# EAGLE design Sedna Monitor Board (EAGLE 9.6.2)
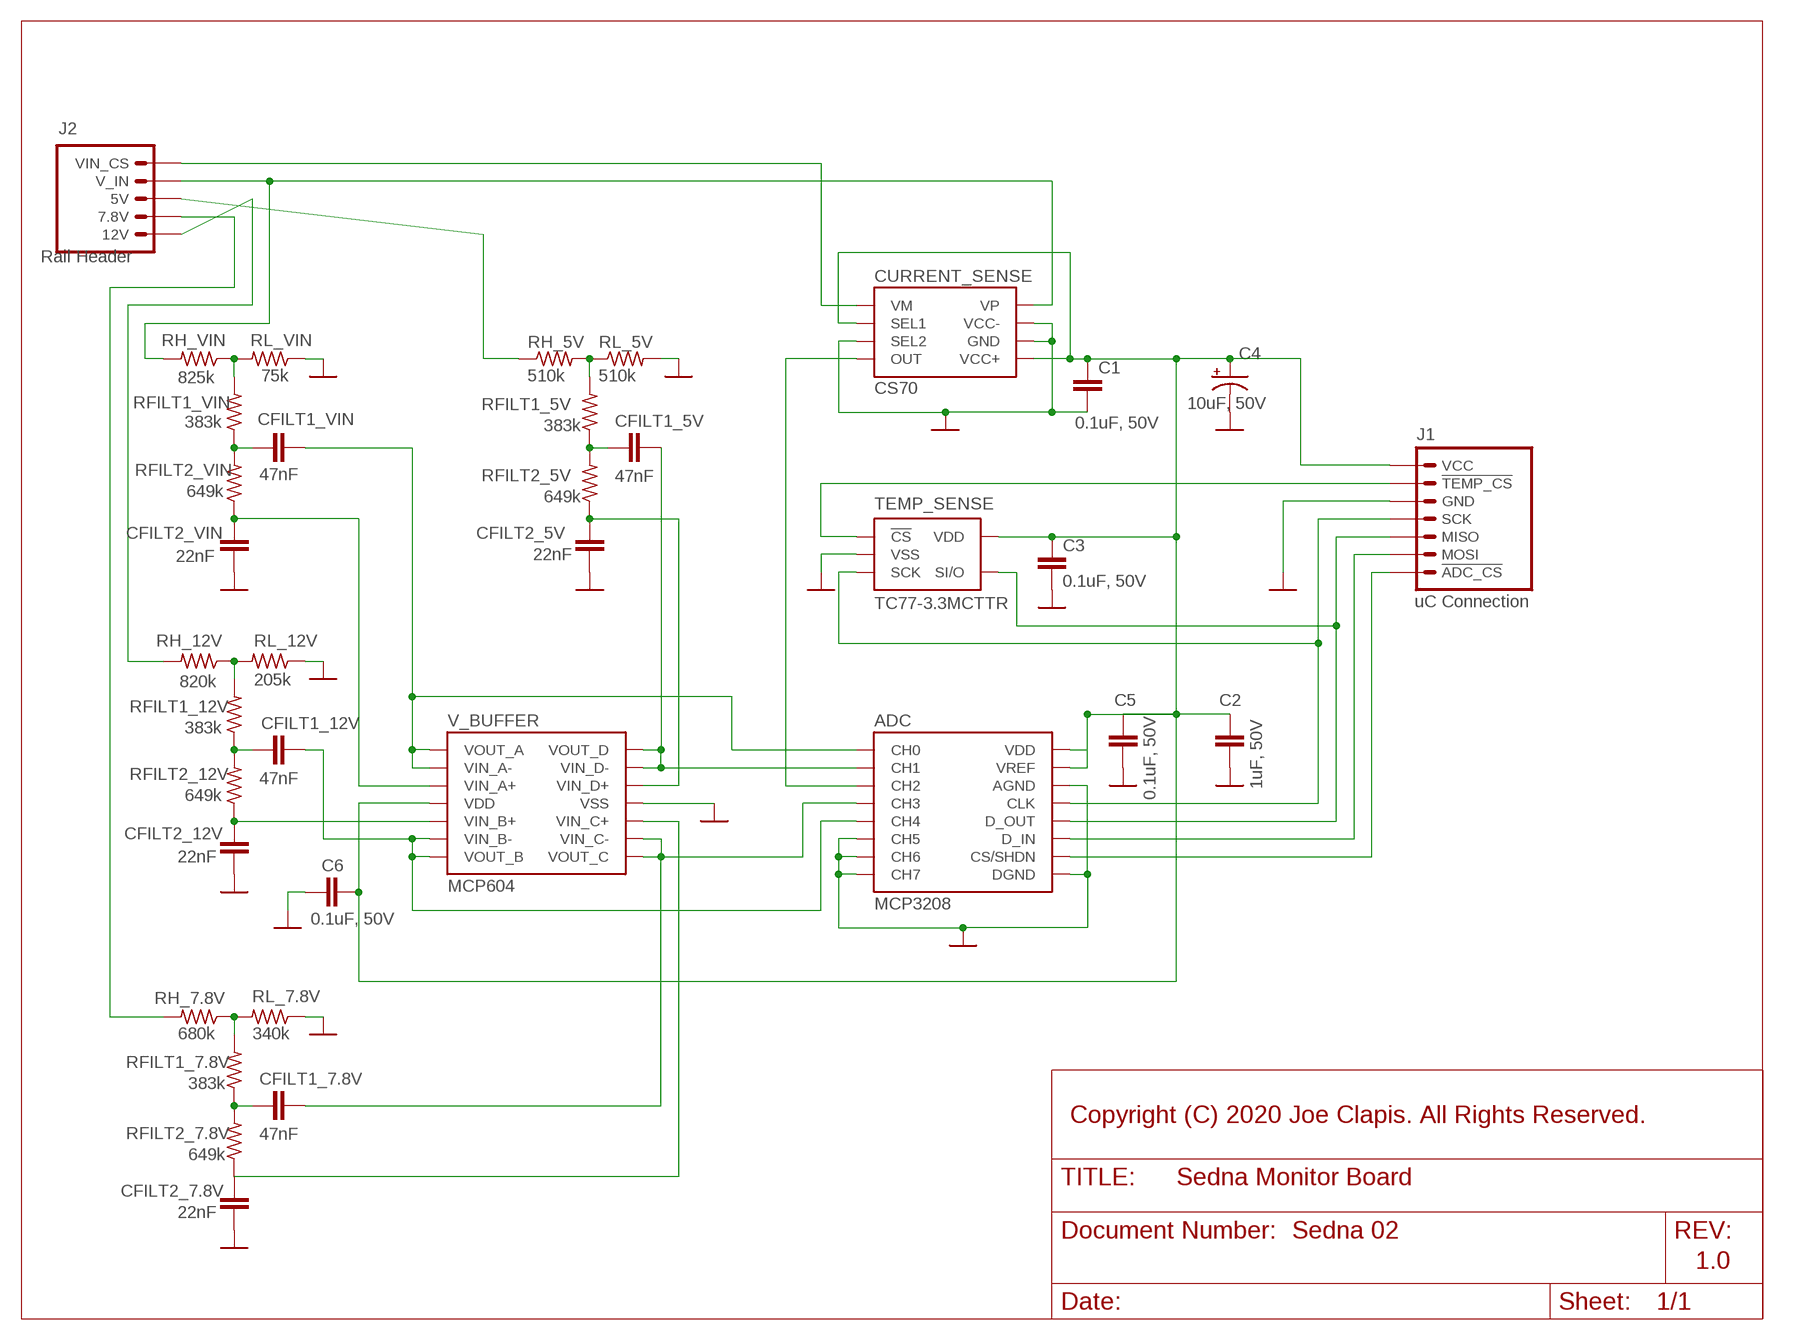
[diagram p0: schematic, sheet 1]

## Parts
ADC  MCP3208  [MICROCHIP_SOIC-16_SL]
C1  0.1uF, 50V  C-EUC0805  [C0805]
C2  1uF, 50V  C-EUC0805  [C0805]
C3  0.1uF, 50V  C-EUC0805  [C0805]
C4  10uF, 50V  PANASONIC-CAP-SV  [PANASONIC-SMD-CAP-SV-D]
C5  0.1uF, 50V  C-EUC0805  [C0805]
C6  0.1uF, 50V  C-EUC0805  [C0805]
CFILT1_5V  47nF  C-EUC0805  [C0805]
CFILT1_7.8V  47nF  C-EUC0805  [C0805]
CFILT1_12V  47nF  C-EUC0805  [C0805]
CFILT1_VIN  47nF  C-EUC0805  [C0805]
CFILT2_5V  22nF  C-EUC0805  [C0805]
CFILT2_7.8V  22nF  C-EUC0805  [C0805]
CFILT2_12V  22nF  C-EUC0805  [C0805]
CFILT2_VIN  22nF  C-EUC0805  [C0805]
CURRENT_SENSE  CS70  [TSSOP8]
J1  uC Connection  UC_MONITOR_HEADER  [1X07]
J2  Rail Header  RAIL_HEADER  [1X05]
RFILT1_5V  383k  R-US_R0805  [R0805]
RFILT1_7.8V  383k  R-US_R0805  [R0805]
RFILT1_12V  383k  R-US_R0805  [R0805]
RFILT1_VIN  383k  R-US_R0805  [R0805]
RFILT2_5V  649k  R-US_R0805  [R0805]
RFILT2_7.8V  649k  R-US_R0805  [R0805]
RFILT2_12V  649k  R-US_R0805  [R0805]
RFILT2_VIN  649k  R-US_R0805  [R0805]
RH_5V  510k  R-US_R0805  [R0805]
RH_7.8V  680k  R-US_R0805  [R0805]
RH_12V  820k  R-US_R0805  [R0805]
RH_VIN  825k  R-US_R0805  [R0805]
RL_5V  510k  R-US_R0805  [R0805]
RL_7.8V  340k  R-US_R0805  [R0805]
RL_12V  205k  R-US_R0805  [R0805]
RL_VIN  75k  R-US_R0805  [R0805]
TEMP_SENSE  TC77-3.3MCTTR  TC77MCT  [MICROCHIP_SOT-23_5_OT]
V_BUFFER  MCP604  MCP604ST  [MICROCHIP_TSSOP-14_ST]

## Nets
ADC_CS: ADC.10(CS/SHDN) J1.7(!ADC_CS)
CS_OUT: ADC.3(CH2) CURRENT_SENSE.4(OUT)
GND: ADC.6(CH5) ADC.7(CH6) ADC.8(CH7) ADC.9(DGND) ADC.14(AGND) C1.2 C2.2 C3.2 C4.GND(-) C5.2 C6.2 CFILT2_5V.1 CFILT2_7.8V.1 CFILT2_12V.1 CFILT2_VIN.1 CURRENT_SENSE.3(SEL2) CURRENT_SENSE.6(GND) CURRENT_SENSE.7(VCC-) J1.3(GND) RL_5V.2 RL_7.8V.1 RL_12V.1 RL_VIN.1 TEMP_SENSE.2(VSS) V_BUFFER.11(VSS)
MOSI: ADC.11(D_IN) J1.6(MOSI)
N$1: ADC.12(D_OUT) J1.5(MISO) TEMP_SENSE.4(SI/O)
N$2: CURRENT_SENSE.1(VM) J2.1(VIN_CS)
N$3: CURRENT_SENSE.8(VP) J2.2(V_IN) RH_VIN.2
N$4: J2.4(7.8V) RH_7.8V.2
N$10: J2.3(5V) RH_5V.1
N$11: RFILT1_12V.2 RH_12V.1 RL_12V.2
N$12: CFILT2_VIN.2 RFILT2_VIN.1 V_BUFFER.3(VIN_A+)
N$13: CFILT1_VIN.1 RFILT1_VIN.1 RFILT2_VIN.2
N$14: J2.5(12V) RH_12V.2
N$15: RFILT1_VIN.2 RH_VIN.1 RL_VIN.2
N$16: CFILT2_12V.2 RFILT2_12V.1 V_BUFFER.5(VIN_B+)
N$17: CFILT1_7.8V.2 RFILT1_7.8V.1 RFILT2_7.8V.2
N$18: CFILT2_7.8V.2 RFILT2_7.8V.1 V_BUFFER.10(VIN_C+)
N$19: RFILT1_7.8V.2 RH_7.8V.1 RL_7.8V.2
N$21: CFILT1_12V.1 RFILT1_12V.1 RFILT2_12V.2
N$22: RFILT1_5V.2 RH_5V.2 RL_5V.1
N$23: CFILT1_5V.2 RFILT1_5V.1 RFILT2_5V.2
N$25: CFILT2_5V.2 RFILT2_5V.1 V_BUFFER.12(VIN_D+)
SCK: ADC.13(CLK) J1.4(SCK) TEMP_SENSE.3(SCK)
TC77_CS: J1.2(!TEMP_CS) TEMP_SENSE.1(!CS)
VDD: ADC.15(VREF) ADC.16(VDD) C1.1 C2.1 C3.1 C4.VDD(+) C5.1 C6.1 CURRENT_SENSE.2(SEL1) CURRENT_SENSE.5(VCC+) J1.1(VCC) TEMP_SENSE.5(VDD) V_BUFFER.4(VDD)
VOUT_A: ADC.1(CH0) CFILT1_VIN.2 V_BUFFER.1(VOUT_A) V_BUFFER.2(VIN_A-)
VOUT_B: ADC.5(CH4) CFILT1_12V.2 V_BUFFER.6(VIN_B-) V_BUFFER.7(VOUT_B)
VOUT_C: ADC.4(CH3) CFILT1_7.8V.1 V_BUFFER.8(VOUT_C) V_BUFFER.9(VIN_C-)
VOUT_D: ADC.2(CH1) CFILT1_5V.1 V_BUFFER.13(VIN_D-) V_BUFFER.14(VOUT_D)

## Notes on the sheet
- Copyright (C) 2020 Joe Clapis. All Rights Reserved.
- Sedna 02
- 1.0

## Library data of the parts
ADC = Sedna Components:MCP3208: The MCP3208 <https://www.mouser.com/datasheet/2/268/21298e-1101808.pdf> is an 8-channel ADC.
C1-C3 C5 C6 CFILT1_5V CFILT1_7.8V CFILT1_12V CFILT1_VIN CFILT2_5V CFILT2_7.8V CFILT2_12V CFILT2_VIN = rcl:C-EU: CAPACITOR, European symbol; SPICEPREFIX: C
C4 = Sedna Components:PANASONIC-CAP-SV
CURRENT_SENSE = Sedna Components:CS70
J1 = Sedna Components:UC_MONITOR_HEADER
J2 = Sedna Components:RAIL_HEADER: This is the rail voltage header for the Monitor Board.
RFILT1_5V RFILT1_7.8V RFILT1_12V RFILT1_VIN RFILT2_5V RFILT2_7.8V RFILT2_12V RFILT2_VIN RH_5V RH_7.8V RH_12V RH_VIN RL_5V RL_7.8V RL_12V RL_VIN = rcl:R-US_: RESISTOR, American symbol; SPICEPREFIX: R
TEMP_SENSE = Sedna Components:TC77: The Microchip TC77 <https://www.mouser.com/datasheet/2/268/20092a-72501.pdf> is a digital temperature sensor with SPI support.
V_BUFFER = Sedna Components:MCP604: The MCP604 <https://www.mouser.com/datasheet/2/268/21314f-29012.pdf> is a quad-input Op Amp.

## Board
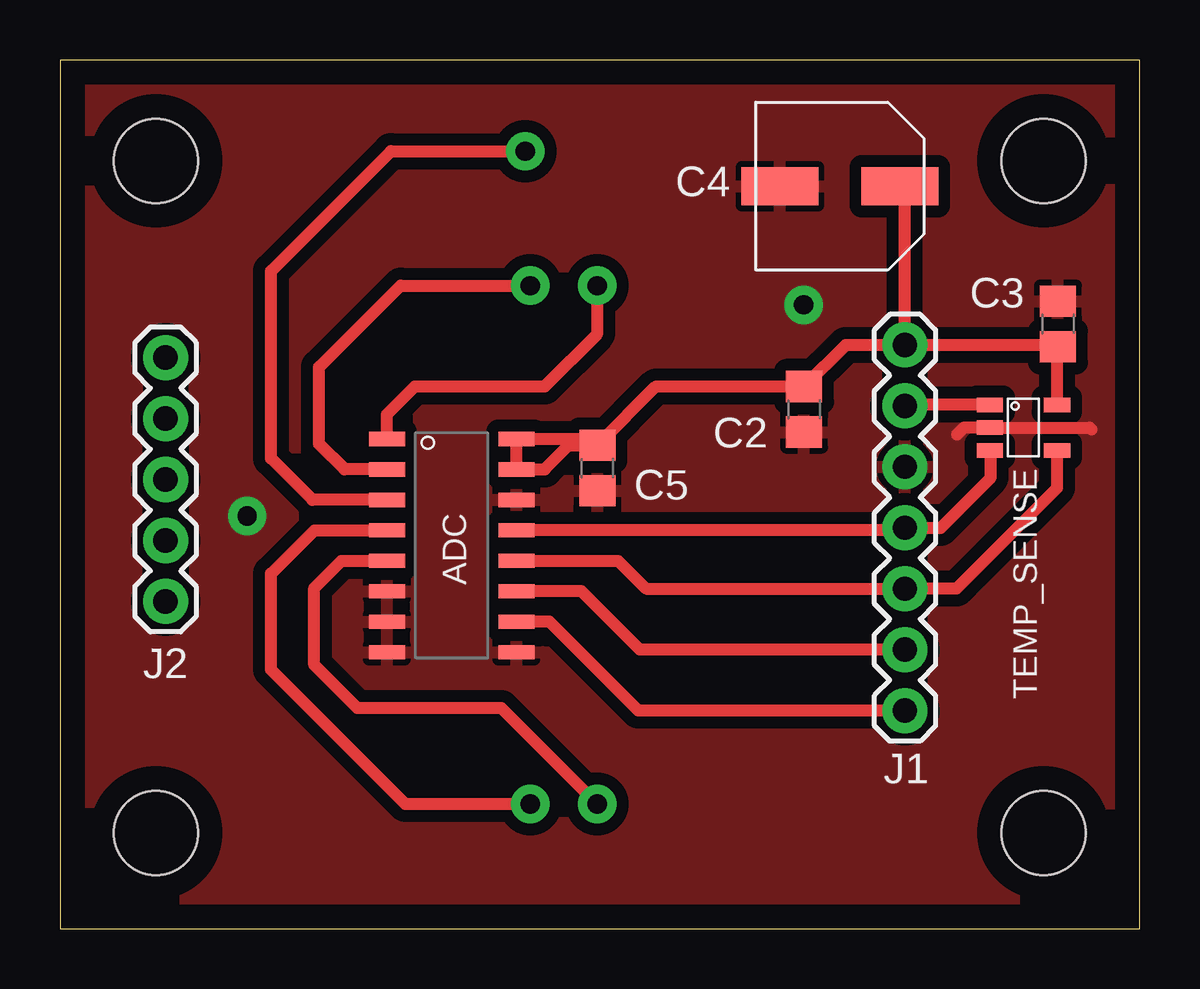
[diagram p1: board, top side]
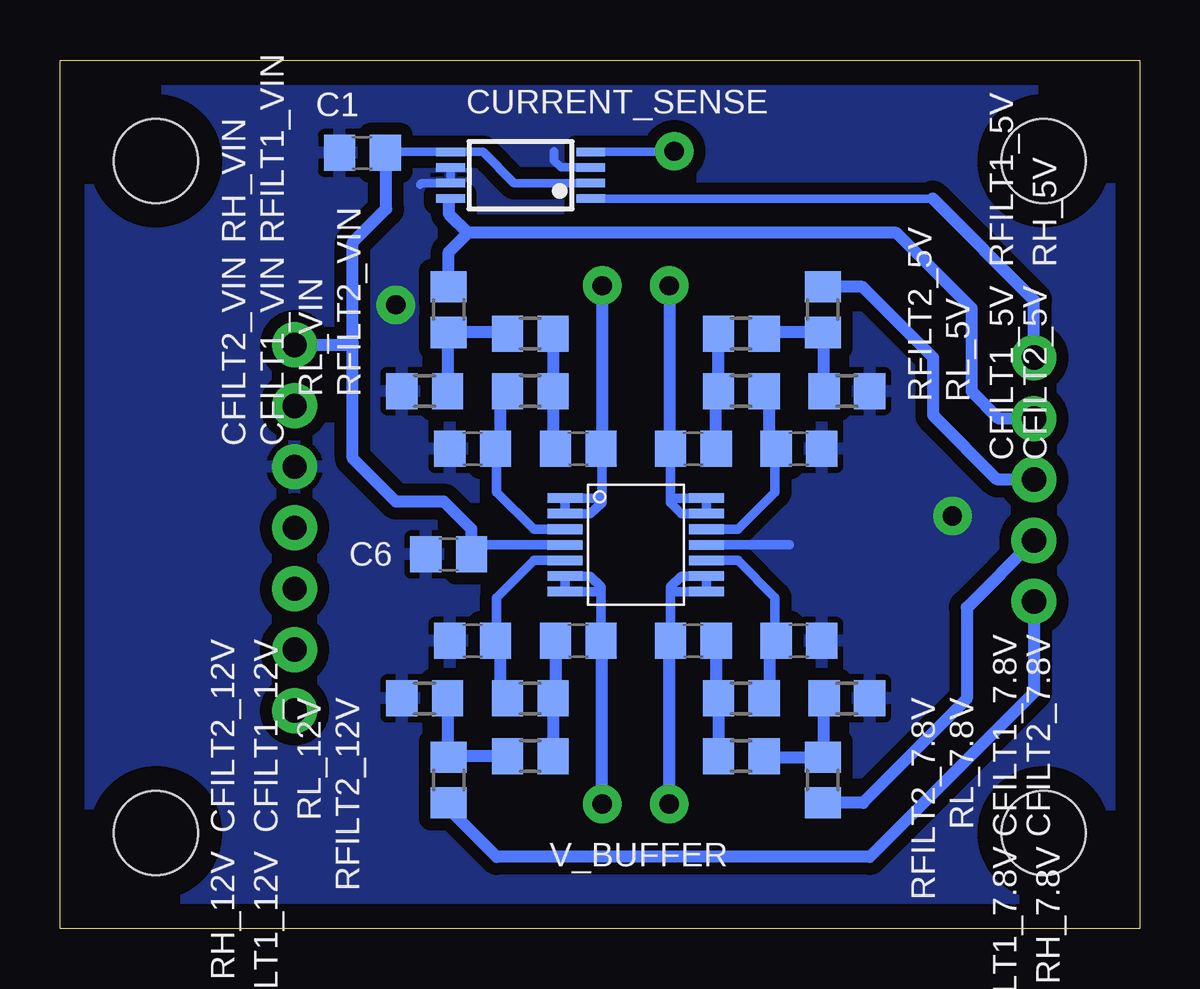
[diagram p2: board, bottom side, seen from below]

Size 45 x 36.2 mm. Coordinates in mm from the lower left corner, seen from the top.
Outline: 0,0 45,0 45,36.2 0,36.2 0,0
Copper layers (1*16): Top 0.035mm / dielectric 1.5mm / Bottom 0.035mm
Design rules "default": minimum track width 6mil, minimum drill 0.35mm, track to track 6mil, track to pad 6mil, pad to pad 6mil, via to via 6mil, smd to smd 6mil, copper to edge 40mil, drill to drill 6mil, minimum pad ring 10mil, minimum via ring 8mil, stop-mask expansion 4mil, vias tented up to drill 0mil, thermal gap 10mil
Holes 3.5 mm at 4,4 4,32 41,32 41,4

### Footprints (pad centres in the part's own frame; a part is rotated, then mirrored left to right if it is on the bottom)
MICROCHIP_SOIC-16_SL = smd 1.5 x 0.6: 1 -2.7,4.445; 2 -2.7,3.175; 3 -2.7,1.905; 4 -2.7,0.635; 5 -2.7,-0.635; 6 -2.7,-1.905; 7 -2.7,-3.175; 8 -2.7,-4.445; 9 2.7,-4.445; 10 2.7,-3.175; 11 2.7,-1.905; 12 2.7,-0.635; 13 2.7,0.635; 14 2.7,1.905; 15 2.7,3.175; 16 2.7,4.445
C0805 = smd 1.3 x 1.5: 1 -0.95,0; 2 0.95,0
PANASONIC-SMD-CAP-SV-D = smd 1.6 x 3.2: GND 0,-2.5; VDD 0,2.5
TSSOP8 = smd 1.2 x 0.35: 1 -2.925,0.975; 2 -2.925,0.325; 3 -2.925,-0.325; 4 -2.925,-0.975; 5 2.925,-0.975; 6 2.925,-0.325; 7 2.925,0.325; 8 2.925,0.975
1X07 = drill 1.016 pad 1.88: 1 0,0; 2 2.54,0; 3 5.08,0; 4 7.62,0; 5 10.16,0; 6 12.7,0; 7 15.24,0
1X05 = drill 1.016 pad 1.88: 1 0,0; 2 2.54,0; 3 5.08,0; 4 7.62,0; 5 10.16,0
R0805 = smd 1.3 x 1.5: 1 -0.95,0; 2 0.95,0
MICROCHIP_SOT-23_5_OT = smd 1.1 x 0.6: 1 -1.4,0.95; 2 -1.4,0; 3 -1.4,-0.95; 4 1.4,-0.95; 5 1.4,0.95
MICROCHIP_TSSOP-14_ST = smd 1.45 x 0.4: 1 -2.95,1.95; 2 -2.95,1.3; 3 -2.95,0.65; 4 -2.95,0; 5 -2.95,-0.65; 6 -2.95,-1.3; 7 -2.95,-1.95; 8 2.95,-1.95; 9 2.95,-1.3; 10 2.95,-0.65; 11 2.95,0; 12 2.95,0.65; 13 2.95,1.3; 14 2.95,1.95

### Placement (x,y rotation side)
ADC  16.33,15.97 0 top
C1  32.39,32.33 180 bottom
C2  31.02,21.65 270 top
C3  41.6,25.2 90 top
C4  32.51,30.94 270 top
C5  22.4,19.2 270 top
C6  28.8,15.6 180 bottom
CFILT1_5V  18.6,20 0 bottom
CFILT1_7.8V  18.6,12 0 bottom
CFILT1_12V  23.4,12 0 bottom
CFILT1_VIN  23.4,20 0 bottom
CFILT2_5V  14.2,20 180 bottom
CFILT2_7.8V  14.2,12 180 bottom
CFILT2_12V  27.8,12 0 bottom
CFILT2_VIN  27.8,20 0 bottom
CURRENT_SENSE  25.8,31.4 180 bottom
J1  35.22,24.33 270 top
J2  4.4,23.8 270 top
RFILT1_5V  16.6,24.8 0 bottom
RFILT1_7.8V  16.6,7.2 0 bottom
RFILT1_12V  25.4,7.2 180 bottom
RFILT1_VIN  25.4,24.8 180 bottom
RFILT2_5V  16.6,22.4 180 bottom
RFILT2_7.8V  16.6,9.6 180 bottom
RFILT2_12V  25.4,9.6 0 bottom
RFILT2_VIN  25.4,22.4 0 bottom
RH_5V  13.2,25.8 270 bottom
RH_7.8V  13.2,6.2 270 bottom
RH_12V  28.8,6.2 270 bottom
RH_VIN  28.8,25.8 90 bottom
RL_5V  12.2,22.4 0 bottom
RL_7.8V  12.2,9.6 180 bottom
RL_12V  29.8,9.6 0 bottom
RL_VIN  29.8,22.4 0 bottom
TEMP_SENSE  40.16,20.88 0 top
V_BUFFER  21,16 0 bottom

### Tracks (layer width: path | path; a pad name or v marks a point on that pad's centre or on a via)
ADC_CS
  Top 0.5: J1.7 24.11,9.09 20.4,12.8 ADC.10
CS_OUT  (via drill 0.8 pad 1.6)
  Top 0.5: ADC.3 10.53,17.88 8.8,19.6 8.8,27.4 13.8,32.4 v19.4,32.4
  Bottom 0.35: CURRENT_SENSE.4 19.43,32.38 v19.4,32.4
GND  (via drill 0.8 pad 1.6)
  Top 0.5: 37.4,20.6 37.68,20.88 TEMP_SENSE.2 42.92,20.88 43,20.8
  Bottom 0.35: 30,31 29.93,31.07 CURRENT_SENSE.7 CURRENT_SENSE.6 | CURRENT_SENSE.3 24.12,31.73 24.4,32 24.4,32.4
  Bottom 0.4: V_BUFFER.11 14.6,16
  other vias: 7.8,17.2 31,26
  pour Top (isolate 0.5): 0,36 0,0 45,0 45,36
  pour Bottom (isolate 0.5): 0,36 0,0 45,0 45,36
MOSI
  Top 0.5: J1.6 24.17,11.63 21.73,14.06 ADC.11
N$1
  Top 0.5: TEMP_SENSE.4 41.56,18.36 37.37,14.17 J1.5 24.43,14.17 23.27,15.34 ADC.12
N$2
  Bottom 0.35: CURRENT_SENSE.1 8.62,30.43
  Bottom 0.5: 8.62,30.43 4.4,26.2 J2.1
N$3
  Bottom 0.35: CURRENT_SENSE.8 28.8,30.35
  Bottom 0.5: 28.8,30.35 28.8,29.8 28,29 | 28,29 10.14,29 7,25.86 7,22.4 5.86,21.26 J2.2 | RH_VIN.2 28.8,28.2 28,29
N$4
  Bottom 0.5: J2.4 7.2,13.38 7.2,9.58 11.53,5.25 RH_7.8V.2
N$10
  Bottom 0.5: J2.3 5.92,18.72 8.6,21.4 8.6,23.8 11.55,26.75 RH_5V.1
N$11
  Bottom 0.5: RL_12V.2 28.85,7.2 | 28.85,7.2 RH_12V.1 | RFILT1_12V.2 28.85,7.2
N$12
  Bottom 0.4: V_BUFFER.3 25.25,16.65 26.8,18.2 26.8,19.4 26.6,19.6 26.6,19.75 CFILT2_VIN.2
  Bottom 0.5: RFILT2_VIN.1 26.65,22.1 26.65,20.2 CFILT2_VIN.2
N$13
  Bottom 0.5: CFILT1_VIN.1 24.45,20.1 RFILT2_VIN.2 RFILT1_VIN.1
N$14
  Bottom 0.5: J2.5 4.4,9.84 11.24,3 26.8,3 28.8,5 RH_12V.2
N$15
  Bottom 0.5: RFILT1_VIN.2 26.4,24.85 RH_VIN.1 28.85,24.8 RL_VIN.2
N$16
  Bottom 0.4: V_BUFFER.5 25.25,15.35 26.8,13.8 26.8,12.05 CFILT2_12V.2 26.65,11.8 | RFILT2_12V.1 26.65,9.9
  Bottom 0.5: 26.65,11.8 26.65,9.9
N$17
  Bottom 0.5: CFILT1_7.8V.2 17.65,9.7 RFILT2_7.8V.2 RFILT1_7.8V.1
N$18
  Bottom 0.4: V_BUFFER.10 16.75,15.35 15.2,13.8 15.2,12.05 | 15.4,12.25 15.2,12.05 | 15.2,12.05 CFILT2_7.8V.2
  Bottom 0.5: RFILT2_7.8V.1 15.4,9.85 15.4,12.25
N$19
  Bottom 0.5: RFILT1_7.8V.2 15.6,7.15 RH_7.8V.1 13.15,7.2 RL_7.8V.2
N$21
  Bottom 0.4: 24.35,9.7 RFILT2_12V.2
  Bottom 0.5: CFILT1_12V.1 24.35,9.7 | RFILT2_12V.2 RFILT1_12V.1
N$22
  Bottom 0.5: RL_5V.1 13.15,24.8 RH_5V.2 15.6,24.85 RFILT1_5V.2
N$23
  Bottom 0.5: CFILT1_5V.2 17.65,22.3 RFILT2_5V.2 RFILT1_5V.1
N$25
  Bottom 0.4: V_BUFFER.12 16.75,16.65 15.2,18.2 15.2,19.95 CFILT2_5V.2
  Bottom 0.5: RFILT2_5V.1 15.45,22.2 15.45,20.2 15.2,19.95
SCK
  Top 0.5: TEMP_SENSE.3 38.8,19.89 38.8,18.8 36.71,16.71 J1.4 35.12,16.61 ADC.13
TC77_CS
  Top 0.5: TEMP_SENSE.1 35.26,21.83 J1.2
VDD
  Top 0.5: TEMP_SENSE.5 41.57,24.22 C3.1 41.52,24.33 J1.1 | C5.1 22.14,20.41 ADC.16 ADC.15 20.2,19.14 21.2,20.15 C5.1 | C5.1 24.85,22.6 C2.1 32.75,24.33 J1.1 | C4.VDD 35.22,30.73 J1.1
  Bottom 0.35: CURRENT_SENSE.2 26.07,31.07 27.38,32.38 CURRENT_SENSE.5 31.39,32.38 C1.1
  Bottom 0.4: V_BUFFER.4 27.45,16 C6.1
  Bottom 0.5: C1.1 31.4,32.29 31.4,30 32.8,28.6 32.8,24.4 | C6.1 27.85,16.65 29,17.8 31,17.8 32.8,19.6 32.8,24.4 | J1.1 32.87,24.33 32.8,24.4
VOUT_A  (via drill 0.8 pad 1.6)
  Top 0.5: ADC.1 13.63,21.43 14.8,22.6 20.2,22.6 22.4,24.8 v22.4,26.8
  Bottom 0.4: 22.4,18 22.4,17.75 22.9,17.3 V_BUFFER.2 V_BUFFER.1 22.45,17.95 22.4,18 | 22.4,18 22.4,20.05
  Bottom 0.5: v22.4,26.8 22.4,20.05 CFILT1_VIN.2
VOUT_B  (via drill 0.8 pad 1.6)
  Top 0.5: v22.4,5.2 18.4,9.2 12.4,9.2 10.6,11 10.6,14.2 11.73,15.34 ADC.5
  Bottom 0.4: 22.45,14 22.45,14.25 22.9,14.7 V_BUFFER.6 V_BUFFER.7 22.5,14.05 22.45,14 | 22.45,14 CFILT1_12V.2 22.4,11.95
  Bottom 0.5: v22.4,5.2 22.4,11.95
VOUT_C  (via drill 0.8 pad 1.6)
  Top 0.5: v19.6,5.2 14.4,5.2 8.8,10.8 8.8,14.8 10.61,16.61 ADC.4
  Bottom 0.4: 19.55,14.05 19.55,14.25 19.1,14.7 V_BUFFER.9 V_BUFFER.8 19.55,14.05 | 19.55,14.05 CFILT1_7.8V.1
  Bottom 0.5: v19.6,5.2 19.6,11.95 CFILT1_7.8V.1
VOUT_D  (via drill 0.8 pad 1.6)
  Top 0.5: ADC.2 11.86,19.14 10.8,20.2 10.8,23.4 14.2,26.8 v19.6,26.8
  Bottom 0.4: 19.55,18 19.55,17.75 19.1,17.3 V_BUFFER.13 V_BUFFER.14 19.5,17.95 19.55,18 | 19.55,18 CFILT1_5V.1
  Bottom 0.5: v19.6,26.8 19.6,20.05 CFILT1_5V.1

### Text on the board
tDocu: Sedna Monitor / Board v1.0